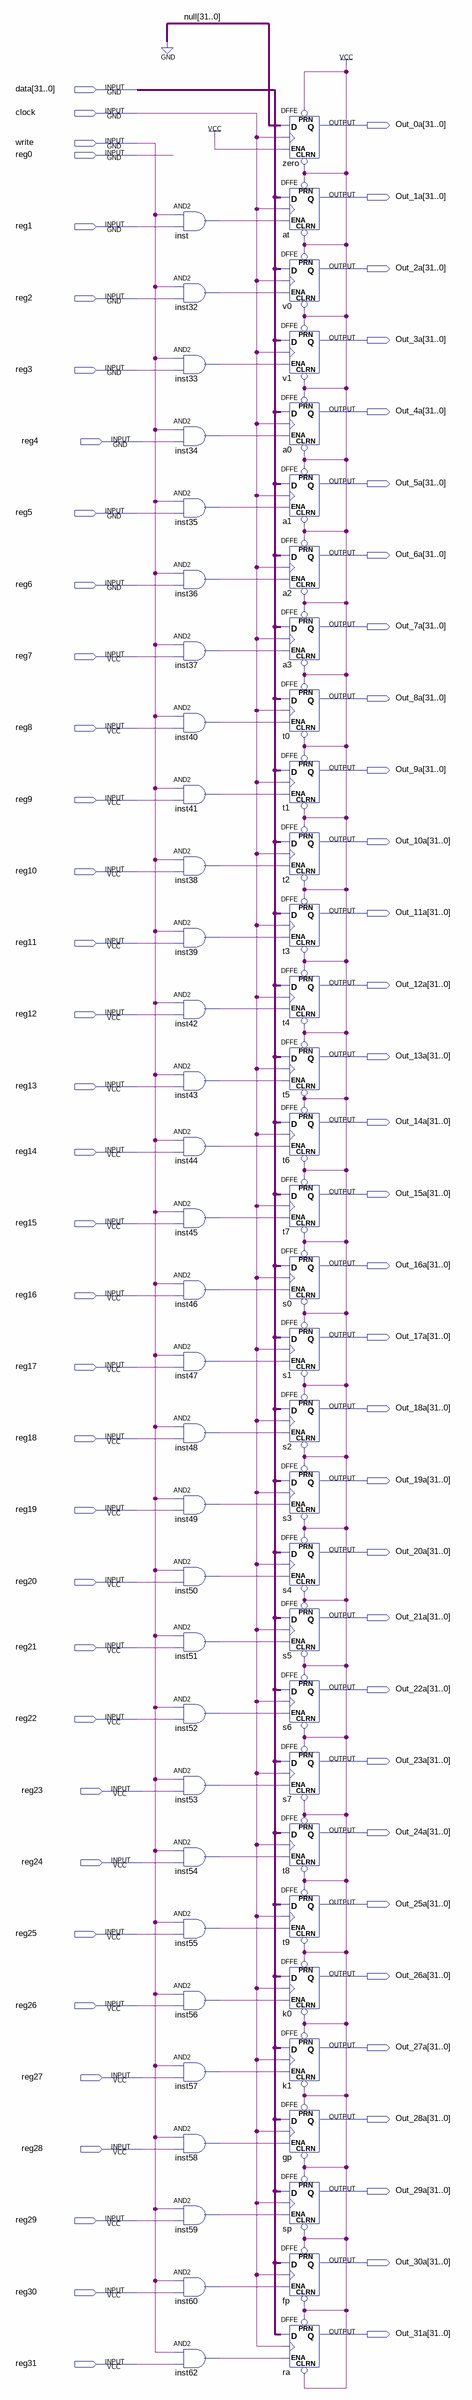
[diagram p0: schematic sheet]
// Quartus schematic Registradores.bdf as structural Verilog: 63 symbols, 67 pins
module Registradores (
  input  [31:0] data,
  input  clock,
  input  write,
  input  reg0,
  input  reg1,
  input  reg2,
  input  reg3,
  input  reg4,
  input  reg5,
  input  reg6,
  input  reg7,
  input  reg8,
  input  reg9,
  input  reg10,
  input  reg11,
  input  reg12,
  input  reg13,
  input  reg14,
  input  reg15,
  input  reg16,
  input  reg17,
  input  reg18,
  input  reg19,
  input  reg20,
  input  reg21,
  input  reg22,
  input  reg23,
  input  reg24,
  input  reg25,
  input  reg26,
  input  reg27,
  input  reg28,
  input  reg29,
  input  reg30,
  input  reg31,
  output [31:0] Out_0a,
  output [31:0] Out_1a,
  output [31:0] Out_2a,
  output [31:0] Out_3a,
  output [31:0] Out_4a,
  output [31:0] Out_5a,
  output [31:0] Out_6a,
  output [31:0] Out_7a,
  output [31:0] Out_8a,
  output [31:0] Out_9a,
  output [31:0] Out_10a,
  output [31:0] Out_11a,
  output [31:0] Out_12a,
  output [31:0] Out_13a,
  output [31:0] Out_14a,
  output [31:0] Out_15a,
  output [31:0] Out_16a,
  output [31:0] Out_17a,
  output [31:0] Out_18a,
  output [31:0] Out_19a,
  output [31:0] Out_20a,
  output [31:0] Out_21a,
  output [31:0] Out_22a,
  output [31:0] Out_23a,
  output [31:0] Out_24a,
  output [31:0] Out_25a,
  output [31:0] Out_26a,
  output [31:0] Out_27a,
  output [31:0] Out_28a,
  output [31:0] Out_29a,
  output [31:0] Out_30a,
  output [31:0] Out_31a
);

  wire inst32_out, inst33_out, inst34_out, inst35_out, inst36_out, inst37_out, inst38_out, inst39_out,
       inst40_out, inst41_out, inst42_out, inst43_out, inst44_out, inst45_out, inst46_out, inst47_out,
       inst48_out, inst49_out, inst50_out, inst51_out, inst52_out, inst53_out, inst54_out, inst55_out,
       inst56_out, inst57_out, inst58_out, inst59_out, inst60_out, inst62_out, inst_out;

  and inst (inst_out, write, reg1);
  and inst32 (inst32_out, write, reg2);
  and inst33 (inst33_out, write, reg3);
  and inst34 (inst34_out, write, reg4);
  and inst35 (inst35_out, write, reg5);
  and inst36 (inst36_out, write, reg6);
  and inst37 (inst37_out, write, reg7);
  and inst40 (inst40_out, write, reg8);
  and inst41 (inst41_out, write, reg9);
  and inst38 (inst38_out, write, reg10);
  and inst39 (inst39_out, write, reg11);
  and inst42 (inst42_out, write, reg12);
  and inst43 (inst43_out, write, reg13);
  and inst44 (inst44_out, write, reg14);
  and inst45 (inst45_out, write, reg15);
  and inst46 (inst46_out, write, reg16);
  and inst47 (inst47_out, write, reg17);
  and inst48 (inst48_out, write, reg18);
  and inst49 (inst49_out, write, reg19);
  and inst50 (inst50_out, write, reg20);
  and inst51 (inst51_out, write, reg21);
  and inst52 (inst52_out, write, reg22);
  and inst53 (inst53_out, write, reg23);
  and inst54 (inst54_out, write, reg24);
  and inst55 (inst55_out, write, reg25);
  and inst56 (inst56_out, write, reg26);
  and inst57 (inst57_out, write, reg27);
  and inst58 (inst58_out, write, reg28);
  and inst59 (inst59_out, write, reg29);
  and inst60 (inst60_out, write, reg30);
  and inst62 (inst62_out, write, reg31);
  DFFE zero[31:0] (.PRN(1'b1), .CLRN(1'b1), .D({32{1'b0}}), .CLK(clock), .ENA(1'b1), .Q(Out_0a));
  DFFE at[31:0] (.PRN(1'b1), .CLRN(1'b1), .D(data), .CLK(clock), .ENA(inst_out), .Q(Out_1a));
  DFFE v0[31:0] (.PRN(1'b1), .CLRN(1'b1), .D(data), .CLK(clock), .ENA(inst32_out), .Q(Out_2a));
  DFFE v1[31:0] (.PRN(1'b1), .CLRN(1'b1), .D(data), .CLK(clock), .ENA(inst33_out), .Q(Out_3a));
  DFFE a0[31:0] (.PRN(1'b1), .CLRN(1'b1), .D(data), .CLK(clock), .ENA(inst34_out), .Q(Out_4a));
  DFFE a1[31:0] (.PRN(1'b1), .CLRN(1'b1), .D(data), .CLK(clock), .ENA(inst35_out), .Q(Out_5a));
  DFFE a2[31:0] (.PRN(1'b1), .CLRN(1'b1), .D(data), .CLK(clock), .ENA(inst36_out), .Q(Out_6a));
  DFFE a3[31:0] (.PRN(1'b1), .CLRN(1'b1), .D(data), .CLK(clock), .ENA(inst37_out), .Q(Out_7a));
  DFFE t0[31:0] (.PRN(1'b1), .CLRN(1'b1), .D(data), .CLK(clock), .ENA(inst40_out), .Q(Out_8a));
  DFFE t1[31:0] (.PRN(1'b1), .CLRN(1'b1), .D(data), .CLK(clock), .ENA(inst41_out), .Q(Out_9a));
  DFFE t2[31:0] (.PRN(1'b1), .CLRN(1'b1), .D(data), .CLK(clock), .ENA(inst38_out), .Q(Out_10a));
  DFFE t3[31:0] (.PRN(1'b1), .CLRN(1'b1), .D(data), .CLK(clock), .ENA(inst39_out), .Q(Out_11a));
  DFFE t4[31:0] (.PRN(1'b1), .CLRN(1'b1), .D(data), .CLK(clock), .ENA(inst42_out), .Q(Out_12a));
  DFFE t5[31:0] (.PRN(1'b1), .CLRN(1'b1), .D(data), .CLK(clock), .ENA(inst43_out), .Q(Out_13a));
  DFFE t6[31:0] (.PRN(1'b1), .CLRN(1'b1), .D(data), .CLK(clock), .ENA(inst44_out), .Q(Out_14a));
  DFFE t7[31:0] (.PRN(1'b1), .CLRN(1'b1), .D(data), .CLK(clock), .ENA(inst45_out), .Q(Out_15a));
  DFFE s0[31:0] (.PRN(1'b1), .CLRN(1'b1), .D(data), .CLK(clock), .ENA(inst46_out), .Q(Out_16a));
  DFFE s1[31:0] (.PRN(1'b1), .CLRN(1'b1), .D(data), .CLK(clock), .ENA(inst47_out), .Q(Out_17a));
  DFFE s2[31:0] (.PRN(1'b1), .CLRN(1'b1), .D(data), .CLK(clock), .ENA(inst48_out), .Q(Out_18a));
  DFFE s3[31:0] (.PRN(1'b1), .CLRN(1'b1), .D(data), .CLK(clock), .ENA(inst49_out), .Q(Out_19a));
  DFFE s4[31:0] (.PRN(1'b1), .CLRN(1'b1), .D(data), .CLK(clock), .ENA(inst50_out), .Q(Out_20a));
  DFFE s5[31:0] (.PRN(1'b1), .CLRN(1'b1), .D(data), .CLK(clock), .ENA(inst51_out), .Q(Out_21a));
  DFFE s6[31:0] (.PRN(1'b1), .CLRN(1'b1), .D(data), .CLK(clock), .ENA(inst52_out), .Q(Out_22a));
  DFFE s7[31:0] (.PRN(1'b1), .CLRN(1'b1), .D(data), .CLK(clock), .ENA(inst53_out), .Q(Out_23a));
  DFFE t8[31:0] (.PRN(1'b1), .CLRN(1'b1), .D(data), .CLK(clock), .ENA(inst54_out), .Q(Out_24a));
  DFFE t9[31:0] (.PRN(1'b1), .CLRN(1'b1), .D(data), .CLK(clock), .ENA(inst55_out), .Q(Out_25a));
  DFFE k0[31:0] (.PRN(1'b1), .CLRN(1'b1), .D(data), .CLK(clock), .ENA(inst56_out), .Q(Out_26a));
  DFFE k1[31:0] (.PRN(1'b1), .CLRN(1'b1), .D(data), .CLK(clock), .ENA(inst57_out), .Q(Out_27a));
  DFFE gp[31:0] (.PRN(1'b1), .CLRN(1'b1), .D(data), .CLK(clock), .ENA(inst58_out), .Q(Out_28a));
  DFFE sp[31:0] (.PRN(1'b1), .CLRN(1'b1), .D(data), .CLK(clock), .ENA(inst59_out), .Q(Out_29a));
  DFFE fp[31:0] (.PRN(1'b1), .CLRN(1'b1), .D(data), .CLK(clock), .ENA(inst60_out), .Q(Out_30a));
  DFFE ra[31:0] (.PRN(1'b1), .CLRN(1'b1), .D(data), .CLK(clock), .ENA(inst62_out), .Q(Out_31a));
endmodule
